# EAGLE design Swiip REV A1 (EAGLE 7.3.0)
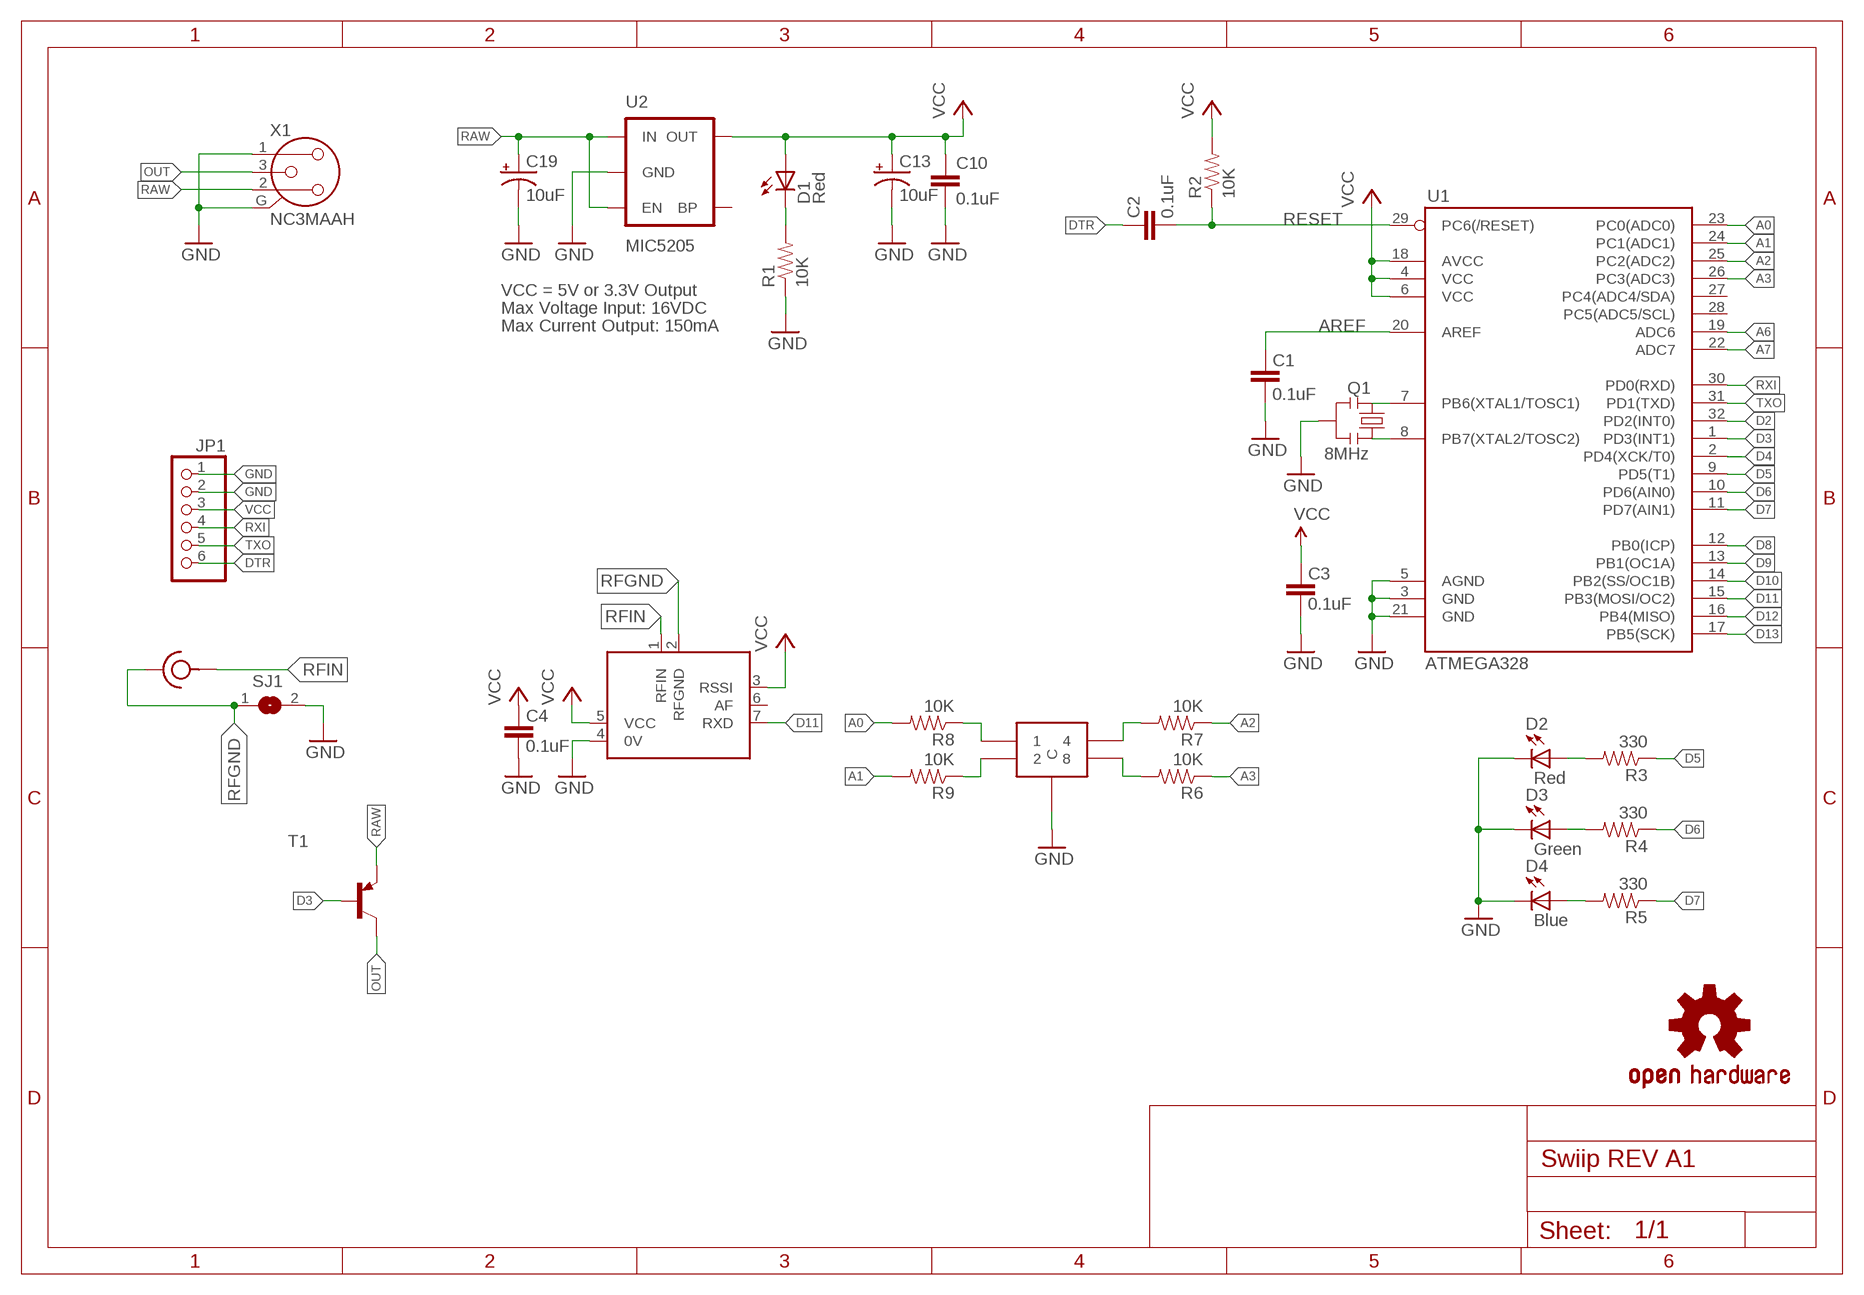
[diagram p0: schematic, sheet 1]

## Parts
C1  0.1uF  CAP0603-CAP  [0603-CAP]
C2  0.1uF  CAP0603-CAP  [0603-CAP]
C3  0.1uF  CAP0603-CAP  [0603-CAP]
C4  0.1uF  CAP0603-CAP  [0603-CAP]
C10  0.1uF  CAP0603-CAP  [0603-CAP]
C13  10uF  CAP_POL1206  [EIA3216]
C19  10uF  CAP_POL1206  [EIA3216]
D1  Red  LED  [0603-LED-ALT1]
D2  Red  LED  [0603-LED-ALT1]
D3  Green  LED  [0603-LED-ALT1]
D4  Blue  LED  [0603-LED-ALT1]
JP1  PINHD-1X6  [1X06]
Q1  8MHz  RESONATOR1:1  [RESONATOR-SMD-1:1]
R1  10K  RESISTOR0603-RES  [0603-RES]
R2  10K  RESISTOR0603-RES  [0603-RES]
R3  330  RESISTOR0603-RES  [0603-RES]
R4  330  RESISTOR0603-RES  [0603-RES]
R5  330  RESISTOR0603-RES  [0603-RES]
R6  10K  RESISTOR0603-RES  [0603-RES]
R7  10K  RESISTOR0603-RES  [0603-RES]
R8  10K  RESISTOR0603-RES  [0603-RES]
R9  10K  RESISTOR0603-RES  [0603-RES]
RF1  132203  [132203]
SJ1  SJ  [SJ]
T1  -PNP-SOT23-BCE  [SOT23-BCE]
U1  ATMEGA328  ATMEGA168  [TQFP32-08]
U2  MIC5205  V_REG_LDOSMD  [SOT23-5]
U$1  PT65-101-L508  [PT65-101-L508]
U$2  RX2A-433-64  [RX2A]
U$3  OSHW-LOGOS  [OSHW-LOGO-S]
X1  NC3MAAH  [NC3MAH]

## Nets
A0: R8.2 U1.23(PC0(ADC0))
A1: R9.2 U1.24(PC1(ADC1))
A2: R7.1 U1.25(PC2(ADC2))
A3: R6.1 U1.26(PC3(ADC3))
A6: U1.19(ADC6)
A7: U1.22(ADC7)
AREF: C1.2 U1.20(AREF)
D2: U1.32(PD2(INT0))
D3: T1.B U1.1(PD3(INT1))
D4: U1.2(PD4(XCK/T0))
D5: R3.1 U1.9(PD5(T1))
D6: R4.1 U1.10(PD6(AIN0))
D7: R5.1 U1.11(PD7(AIN1))
D8: U1.12(PB0(ICP))
D9: U1.13(PB1(OC1A))
D10: U1.14(PB2(SS/OC1B))
D11: U1.15(PB3(MOSI/OC2)) U$2.7(RXD)
D12: U1.16(PB4(MISO))
D13: U1.17(PB5(SCK))
DTR: C2.2 JP1.6
GND [vcc]: C1.1 C3.1 C4.1 C10.2 C13.C(-) C19.C(-) D2.C D3.C D4.C JP1.1 JP1.2 Q1.2 R1.1 SJ1.2 U1.3(GND) U1.5(AGND) U1.21(GND) U2.2(GND) U$1.C1(C) U$1.C2(C) U$2.4(0V) X1.1 X1.G
N$1: Q1.3 U1.8(PB7(XTAL2/TOSC2))
N$2: Q1.1 U1.7(PB6(XTAL1/TOSC1))
N$3: D3.A R4.2
N$4: D1.C R1.2
N$5: D4.A R5.2
N$6: R8.1 U$1.1
N$7: D2.A R3.2
N$8: R9.1 U$1.2
N$9: R7.2 U$1.4
N$10: R6.2 U$1.8
OUT: T1.C X1.3
RAW [vcc]: C19.A(+) T1.E U2.1(IN) U2.3(EN) X1.2
RESET: C2.1 R2.1 U1.29(PC6(/RESET))
RFGND: RF1.G1(GND) RF1.G2(GND) RF1.G3(GND) RF1.G4(GND) SJ1.1 U$2.2(RFGND)
RFIN: RF1.P(RF) U$2.1(RFIN)
RXI: JP1.4 U1.30(PD0(RXD))
TXO: JP1.5 U1.31(PD1(TXD))
VCC: C3.2 C4.2 C10.1 C13.A(+) D1.A JP1.3 R2.2 U1.4(VCC) U1.6(VCC) U1.18(AVCC) U2.5(OUT) U$2.3(RSSI) U$2.5(VCC)
Unconnected: U1.27(PC4(ADC4/SDA)) U1.28(PC5(ADC5/SCL)) U2.4(BP) U$2.6(AF)

## Notes on the sheet
- VCC = 5V or 3.3V Output
- Max Voltage Input: 16VDC
- Max Current Output: 150mA

## Library data of the parts
C1-C4 C10 = SparkFun:CAP: Capacitor Standard 0603 ceramic capacitor, and 0.1" leaded capacitor.; MF: MULTICOMP; MPN: MC0603F104Z160CT; OC_FARNELL: 1759017
C13 C19 = SparkFun:CAP_POL: Capacitor Polarized These are standard SMD and PTH capacitors. Normally 10uF, 47uF, and 100uF in electrolytic and tantalum varieties. Always verify the external diameter of the through hole cap, it varies with capacity, voltage, and manufacturer. The EIA devices should be standard.; MF: MULTICOMP; MPN: MCCTA106M006; OC_FARNELL: 1190107
D1 = Testing:LED: LEDs Standard schematic elements and footprints for 5mm, 3mm, 1206, and 0603 sized LEDs. 5mm - Spark Fun Electronics SKU : COM-00529 (and others); MF: MULTICOMP; MPN: MCL-S290SRC; OC_FARNELL: 1581244
D2-D4 = Testing:LED: LEDs Standard schematic elements and footprints for 5mm, 3mm, 1206, and 0603 sized LEDs. 5mm - Spark Fun Electronics SKU : COM-00529 (and others); MF: MULTICOMP; MPN: 703-0109; OC_FARNELL: 2112121
JP1 = pinhead:PINHD-1X6: PIN HEADER; MF: MULTICOMP; MPN: MC34751; OC_FARNELL: 1593430
Q1 = Testing:RESONATOR: Resonator Small SMD resonator. This is the itty bitty 10/20MHz resonators with built in caps. CSTCE10M0G55 and CSTCE20M0V53. Footprint for SMD has been used in SFE production for years, and does work okay. 1:1 is an attempt to get larger fillets on the sides so it will be easier to inspect these solders in our AOI machine. The pads have been minimized to match the actual metal under the resonator. To see this relation, it includes an image import of the bottom side of the component. Imported to scale on layer 200.; MF: MURATA; MPN: CSTCE8M00G55Z-R0; OC_FARNELL: 1615352
R1 R2 R6-R9 = SparkFun:RESISTOR: Resistor Basic schematic elements and footprints for 0603, 1206, and PTH resistors.; MF: MULTICOMP; MPN: MCHP03W8F1002T5E; OC_FARNELL: 1576297
R3-R5 = SparkFun:RESISTOR: Resistor Basic schematic elements and footprints for 0603, 1206, and PTH resistors.; MF: MULTICOMP; MPN: MCWR06X3300FTL; OC_FARNELL: 2447339
RF1 = amphenol:132203; MF: AMPHENOL CONNEX; MPN: 132203; OC_FARNELL: 2144524
SJ1 = jumper:SJ: SMD solder JUMPER; OC_FARNELL: unknown
T1 = transistor:*-PNP-: PNP Transistror; MF: NXP; MPN: BC807-25; OC_FARNELL: 1081221
U1 = SparkFun:ATMEGA168; MF: ATMEL; MPN: ATMEGA328-AUR; OC_FARNELL: 2443176
U2 = SparkFun:V_REG_LDO: Voltage Regulator LDO Standard 150mA LDO voltage regulator in SOT-23 layout. Micrel part MIC5205. BP (by-pass) pin is used to lower output noise with 470pF cap.; MF: MICREL SEMICONDUCTOR; MPN: MIC5205-3.0YM5 TR; OC_FARNELL: 2100318
U$1 = apem:PT65-101-?; MF: APEM; MPN: PT65-101-L508; OC_FARNELL: 1082477
U$2 = radiometrix:RX2A; MF: RADIOMETRIX; MPN: RX2A-433-64; OC_FARNELL: 1338543
U$3 = SparkFun:OSHW-LOGO: Open Source Hardware Logo This logo indicates the piece of hardware it is found on incorporates a OSHW license and/or adheres to the definition of open source hardware found here: http://freedomdefined.org/OSHW; OC_FARNELL: unknown
X1 = con-neutrik_ag:NC3: Neutrik Audio Connector XLR SERIES Stereo 1/4" jack Source: www.neutrik.com/; MF: NEUTRIK; MPN: NC3MAAH; OC_FARNELL: 1310044

## Net classes
0 default: width 0.203 mm
1 vcc: width 0.254 mm

## Board
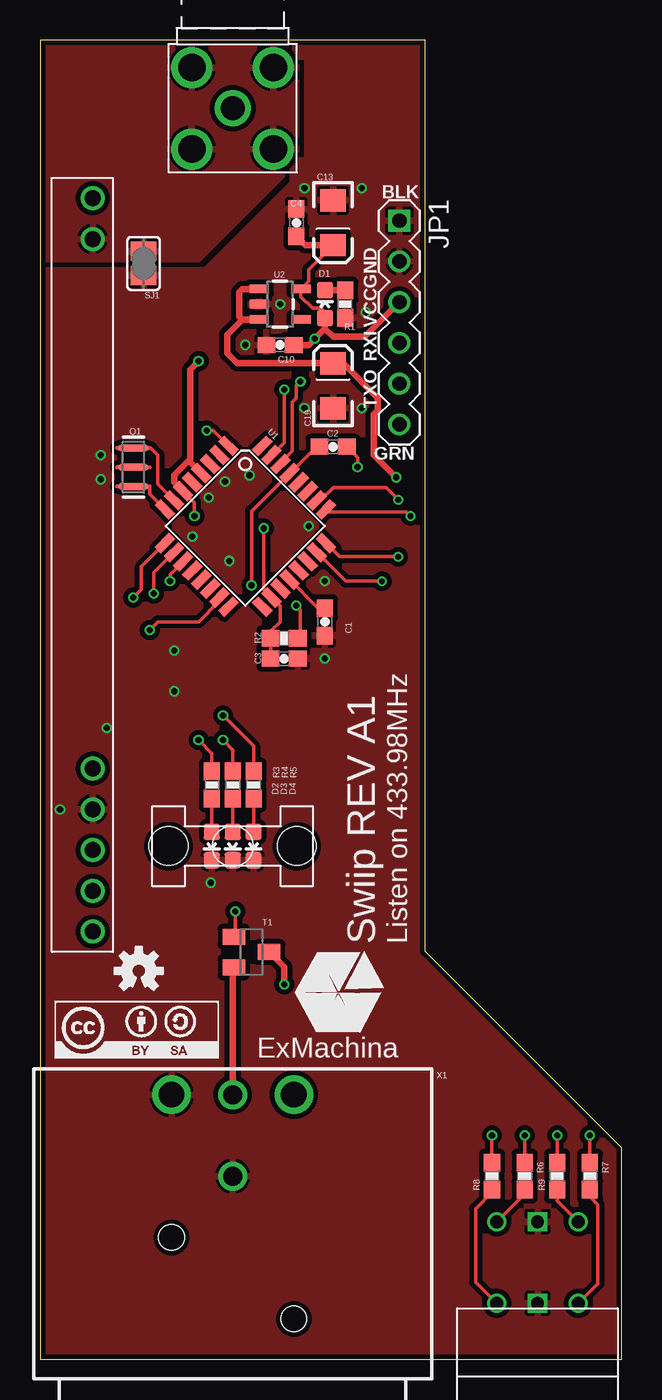
[diagram p1: board, top side]
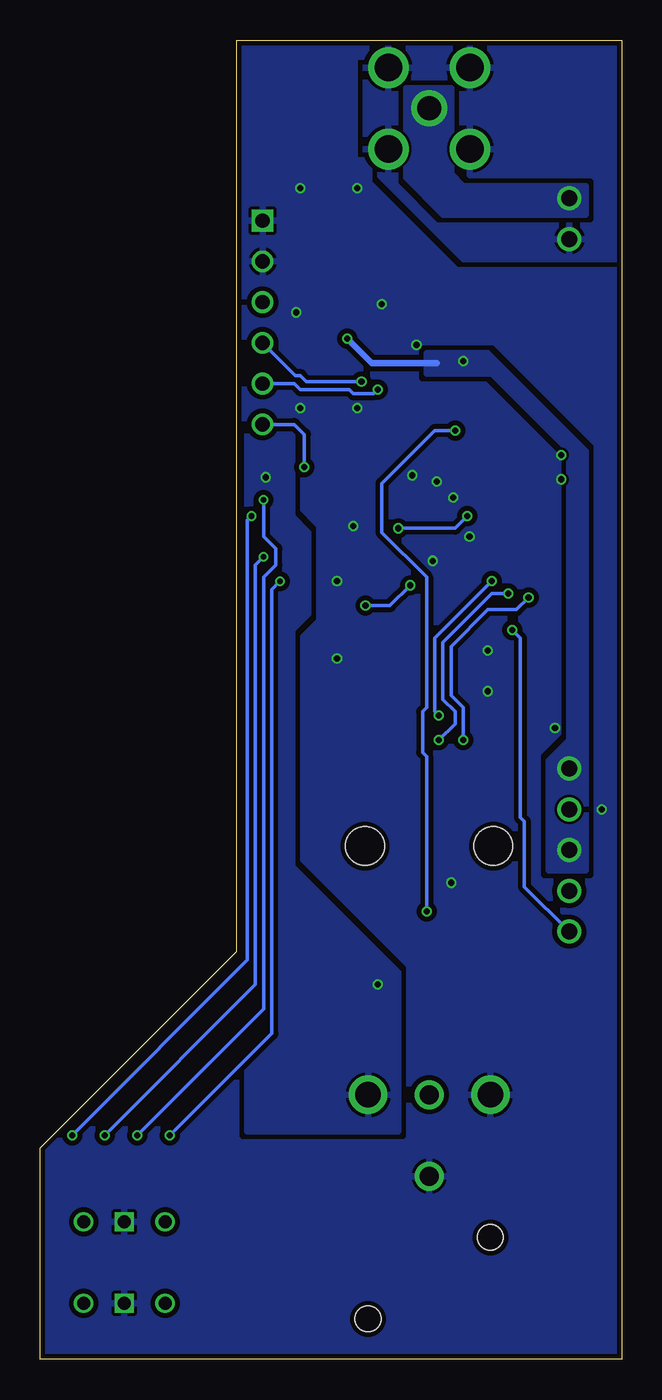
[diagram p2: board, bottom side, seen from below]

Size 36.25 x 82.25 mm. Coordinates in mm from the lower left corner, seen from the top.
Outline: 0,82.25 0,0 36.25,0 36.25,13.18 24,25.43 24,82.25 0,82.25
Copper layers (1*16): Top 0.018mm / dielectric 1.55mm / Bottom 0.018mm
Design rules "eC_2Layer_PClass6_BaseCopperO18_eCDefault": minimum track width 0.15mm, minimum drill 0.35mm, track to track 0.15mm, track to pad 0.15mm, pad to pad 0.15mm, via to via 0.15mm, smd to smd 0mil, copper to edge 0.25mm, drill to drill 0.35mm, minimum pad ring 0.175mm, minimum via ring 0.125mm, stop-mask expansion 0mil, vias tented up to drill 0.45mm, thermal gap 0.2mm

### Footprints (pad centres in the part's own frame; a part is rotated, then mirrored left to right if it is on the bottom)
0603-CAP = smd 1.1 x 1: 1 -0.85,0; 2 0.85,0
EIA3216 = smd 1.4 x 1.6: A 1.4,0; C -1.4,0
0603-LED-ALT1 = smd 1 x 1: A 0,-0.877; C 0,0.877
1X06 = drill 0.9 square: 1 -6.35,0 | drill 0.9: 2 -3.81,0; 3 -1.27,0; 4 1.27,0; 5 3.81,0; 6 6.35,0
RESONATOR-SMD-1:1 = smd 0.45 x 1.905: 1 -1.2,0; 2 0,0; 3 1.2,0
0603-RES = smd 1.1 x 1: 1 -0.85,0; 2 0.85,0
132203 = drill 1.7: G1 -2.54,2.54; G2 2.54,2.54; G3 2.54,-2.54; G4 -2.54,-2.54 | drill 1.5: P 0,0
SJ = smd 1.168 x 1.6: 1 -0.762,0; 2 0.762,0
SOT23-BCE = smd 1 x 1.4: B -0.95,-1.1; C 0.95,-1.1; E 0,1.1
TQFP32-08 = smd 1.27 x 0.559: 1 -4.293,2.8; 2 -4.293,2; 3 -4.293,1.2; 4 -4.293,0.4; 5 -4.293,-0.4; 6 -4.293,-1.2; 7 -4.293,-2; 8 -4.293,-2.8; 17 4.293,-2.8; 18 4.293,-2; 19 4.293,-1.2; 20 4.293,-0.4; 21 4.293,0.4; 22 4.293,1.2; 23 4.293,2; 24 4.293,2.8 | smd 0.559 x 1.27: 9 -2.8,-4.293; 10 -2,-4.293; 11 -1.2,-4.293; 12 -0.4,-4.293; 13 0.4,-4.293; 14 1.2,-4.293; 15 2,-4.293; 16 2.8,-4.293; 25 2.8,4.293; 26 2,4.293; 27 1.2,4.293; 28 0.4,4.293; 29 -0.4,4.293; 30 -1.2,4.293; 31 -2,4.293; 32 -2.8,4.293
SOT23-5 = smd 0.55 x 1.2: 1 -0.95,-1.3; 2 0,-1.3; 3 0.95,-1.3; 4 0.95,1.3; 5 -0.95,1.3
PT65-101-L508 = drill 0.8: 1 2.54,0; 2 -2.54,-5.08; 4 -2.54,0; 8 2.54,-5.08 | drill 0.8 square: C1 0,0; C2 0,-5.08
RX2A = drill 1: 1 -22.86,0; 2 -20.32,0; 3 12.7,0; 4 15.24,0; 5 17.78,0; 6 20.32,0; 7 22.86,0
1275.100 = hole 2.4: 4,0; -4,0
NC3MAH = drill 1.6: 1 3.81,0; 2 -3.81,0 | drill 1.2: 3 0,0; G 0,5.08 | hole 1.6: -3.81,13.97; 3.81,8.89

### Placement (x,y rotation side)
C1  17.75,45.97 90 top
C2  18.26,56.9 0 top
C3  15.21,43.69 180 top
C4  15.97,70.87 270 top
C10  14.95,63.25 180 top
C13  18.26,70.87 270 top
C19  18.26,60.71 90 top
D1  17.75,65.79 0 top
D2  10.7,32 180 top
D3  12,32 180 top
D4  13.3,32 180 top
JP1  22.39,64.64 270 top
Q1  5.81,55.63 270 top
R1  19.02,65.79 90 top
R2  15.21,44.96 180 top
R3  10.7,35.81 270 top
R4  12,35.81 270 top
R5  13.3,35.81 270 top
R6  30.19,11.43 270 top
R7  34.26,11.43 270 top
R8  28.16,11.43 90 top
R9  32.23,11.43 90 top
RF1  12,78 0 top
SJ1  6.45,68.33 270 top
T1  13.18,25.4 270 top
U1  12.8,51.94 315 top
U2  14.95,65.79 270 top
U$1  31,3.5 180 top
U$2  3.27,49.53 270 top
U$3  6.15,24.22 0 top
U$4  [CC-BY-SA]  6.18,21 0 top
U$5  [1275.100]  12,32 0 top
U$6  [EXM-LOGO]  18.58,22.86 0 top
X1  12,16.5 180 top

### Tracks (layer width: path | path; a pad name or v marks a point on that pad's centre or on a via)
A0  (via drill 0.35, 0.38)
  Top 0.203: R8.2 v28.16,13.97 | U1.23 19.05,48.51 v21.3,48.51
  Bottom 0.203: v28.16,13.97 21.81,20.32 21.81,48.01 v21.3,48.51
A1  (via drill 0.35, 0.38)
  Top 0.203: R9.2 v32.23,13.97 | U1.24 18.66,50.04 v22.32,50.04
  Bottom 0.203: v32.23,13.97 22.83,23.37 22.83,49.53 v22.32,50.04
A2  (via drill 0.35, 0.38)
  Top 0.203: R7.1 v34.26,13.97 | v23.08,52.58 22.83,52.83 17.98,52.83 U1.25
  Bottom 0.203: v34.26,13.97 23.34,24.89 23.34,52.32 v23.08,52.58
A3  (via drill 0.35, 0.38)
  Top 0.203: R6.1 v30.19,13.97 | v22.32,53.59 21.56,54.36 18.26,54.36 17.46,53.56 U1.26
  Bottom 0.203: v30.19,13.97 22.32,21.84 22.32,48.77 21.56,49.53 21.56,50.55 22.32,51.31 v22.32,53.59
AREF
  Top 0.203: U1.20 17.35,46.82 C1.2
D3  (via drill 0.38)
  Top 0.203: U1.1 10.79,57.91 v10.38,57.91 | v12.16,27.94 12.16,26.43 T1.B
  Bottom 0.203: v10.38,57.91 11.65,57.91 14.95,54.61 14.95,51.56 12.16,48.77 12.16,40.64 12.41,40.39 12.41,37.85 12.16,37.59 v12.16,27.94
D5  (via drill 0.38)
  Top 0.203: v5.81,47.5 6.32,48.01 6.32,49.43 U1.9 | v9.87,38.61 10.7,37.78 R3.1
  Bottom 0.203: v5.81,47.5 6.57,46.74 8.35,46.74 10.64,44.45 10.64,41.4 9.87,40.64 v9.87,38.61
D6  (via drill 0.38)
  Top 0.203: v7.08,47.75 7.08,49.06 U1.10 | v11.4,38.61 12,38.01 R4.1
  Bottom 0.203: v7.08,47.75 8.1,47.75 11.14,44.7 11.14,41.15 10.38,40.39 10.38,39.62 v11.4,38.61
D7  (via drill 0.38)
  Top 0.203: v8.1,48.51 8.1,48.94 U1.11 | v11.4,40.13 13.3,38.23 R5.1
  Bottom 0.203: v8.1,48.51 11.65,44.96 11.65,40.39 v11.4,40.13
D11  (via drill 0.38)
  Top 0.203: U1.15 11.14,47.49 11.14,47.24 9.87,45.97 7.33,45.97 v6.83,45.47
  Bottom 0.203: U$2.7 6.06,29.46 6.06,33.53 6.32,33.78 6.32,44.96 v6.83,45.47
DTR  (via drill 0.38)
  Top 0.203: C2.2 19.78,56.22 v19.78,55.63
  Bottom 0.203: v19.78,55.63 19.78,57.66 20.41,58.29 JP1.6
GND  (via drill 0.38)
  other vias: 14.95,65.79 20.03,59.31 20.29,65.28 10.51,53.72 17.75,43.69 17.75,48.51 4.16,39.37 8.35,44.2 8.35,41.66 1.24,34.29 10.64,29.72 13.05,55.12 11.52,54.74 16.73,51.94 11.78,49.78 9.49,51.31 3.78,56.39 3.78,54.86 16.48,59.31 20.03,73.03 16.48,73.03 12.8,63.25
  pour Top (isolate 0.305, rank 6): -3,86.14 37,86.14 37,-0.86 -3,-0.86
  pour Bottom (isolate 0.305, rank 6): -3,86.14 37,86.14 37,-0.86 -3,-0.86
N$1
  Top 0.203: 6.83,54.43 6.83,53.95 U1.8
N$2
  Top 0.203: 6.83,56.83 6.9,56.83 7.33,56.39 7.33,54.58 U1.7
N$3
  Top 0.203: R4.2 D3.A
N$4
  Top 0.406: D1.C 18.99,66.66 R1.2
N$5
  Top 0.203: R5.2 D4.A
N$6
  Top 0.203: R8.1 28.16,10.41 27.15,9.4 27.15,4.81 U$1.1
N$7
  Top 0.203: R3.2 D2.A
N$8
  Top 0.203: R9.1 32.23,9.89 U$1.2
N$9
  Top 0.203: R7.2 34.26,10.16 34.77,9.65 34.77,4.73 U$1.4
N$10
  Top 0.203: R6.2 30.19,10.31 U$1.8
OUT
  Top 0.406: T1.C 12,24.37 X1.3
RAW  (via drill 0.38)
  Top 0.406: U2.1 12.6,66.74 12.41,66.55 12.41,65.02 12.6,64.84 | 12.6,64.84 U2.3 | 12.6,64.84 11.65,63.89 11.65,62.74 12.28,62.11 C19.A 18.89,62.11 21.05,59.94 21.05,59.18 20.8,58.93 20.8,56.39 v22.19,54.99 | T1.E 15.21,24.47 v15.21,23.37
  pour Bottom (isolate 0.305): 13.94,14.22 23.34,14.22 23.34,59.44 20.54,59.44 20.54,52.58 19.53,51.56 19.53,46.48 20.54,45.47 20.54,30.73 13.94,24.13
RESET  (via drill 0.38)
  Top 0.203: C2.1 17.24,56.9 15.97,55.63 15.91,55.63 U1.29 13.18,52.89 v13.18,48.26 | v15.97,46.99 16.22,46.74 16.22,45.12 R2.1
  Bottom 0.203: v15.97,46.99 14.45,46.99 v13.18,48.26
RFGND
  pour Bottom (isolate 0.305, rank 2): -1.3,82.04 -1.3,68.58 9.87,68.58 15.97,74.68 15.97,82.04
  pour Top (isolate 0.305, rank 2): -1.3,82.04 -1.3,68.58 9.87,68.58 15.97,74.68 15.97,82.04
RFIN
  pour Bottom (no thermals): 2.25,73.15 2.25,71.37 11.14,71.37 13.43,73.66 13.43,79.25 10.64,79.25 10.64,73.91 9.87,73.15
RXI  (via drill 0.38)
  Top 0.203: v16.22,60.96 15.97,60.71 15.97,59.94 15.72,59.69 15.72,56.64 14.98,55.91 U1.30
  Bottom 0.203: v16.22,60.96 19.65,60.96 20.03,61.34 20.35,61.34 JP1.4
TXO  (via drill 0.38)
  Top 0.203: v15.21,60.45 15.21,57.15 14.45,56.39 U1.31
  Bottom 0.203: v15.21,60.45 15.46,60.2 16.73,60.2 16.99,60.45 20.03,60.45 20.41,60.83 JP1.5
VCC  (via drill 0.38)
  Top 0.203: C3.2 R2.2 14.45,45.05 14.45,45.47 14.95,45.97 14.95,46.96 U1.18 13.94,47.97 v13.94,51.82 | C13.A 16.73,67.94 16.73,67.21 U2.5 16.25,66.26 16.99,65.53 17.49,65.53 17.75,65.28 D1.A | 9.37,55.94 9.37,56.13 | U1.6 9.62,53.42 v9.62,52.58
  Top 0.406: 17.75,64.26 18.26,63.75 20.23,63.75 JP1.3 | 17.75,64.26 D1.A | 17.75,64.26 v17.11,63.63 16.73,63.25 C10.1 | C4.2 16.52,69.47 C13.A | U1.4 9.37,55.94 | v9.87,62.23 9.37,61.72 9.37,56.13 8.35,55.12 8.35,54.69 U1.6
  Bottom 0.203: v9.62,52.58 10.38,51.82 v13.94,51.82
  Bottom 0.406: 11.52,62.1 15.59,62.1 v17.11,63.63
  pour Bottom (no thermals): 4.54,30.48 2.25,30.48 2.25,56.64 8.35,62.74 12.16,62.74 12.16,61.47 8.1,61.47 3.27,56.64 3.27,38.61 4.54,37.34

### Text on the board
tPlace: BLK | GND | VCC | RXI | TXO | GRN
tNames: Swiip REV A1 | Listen on 433.98MHz | ExMachina
Document: Released under the Creative Commons Attribution Share-Alike 3.0 License / http://creativecommons.org/licenses/by-sa/3.0 / Inspired from Arduino Pro Mini design / Designed by Benoit Rapidel - ExMachina